# Altium project GardenSense Rev B.PrjPcb
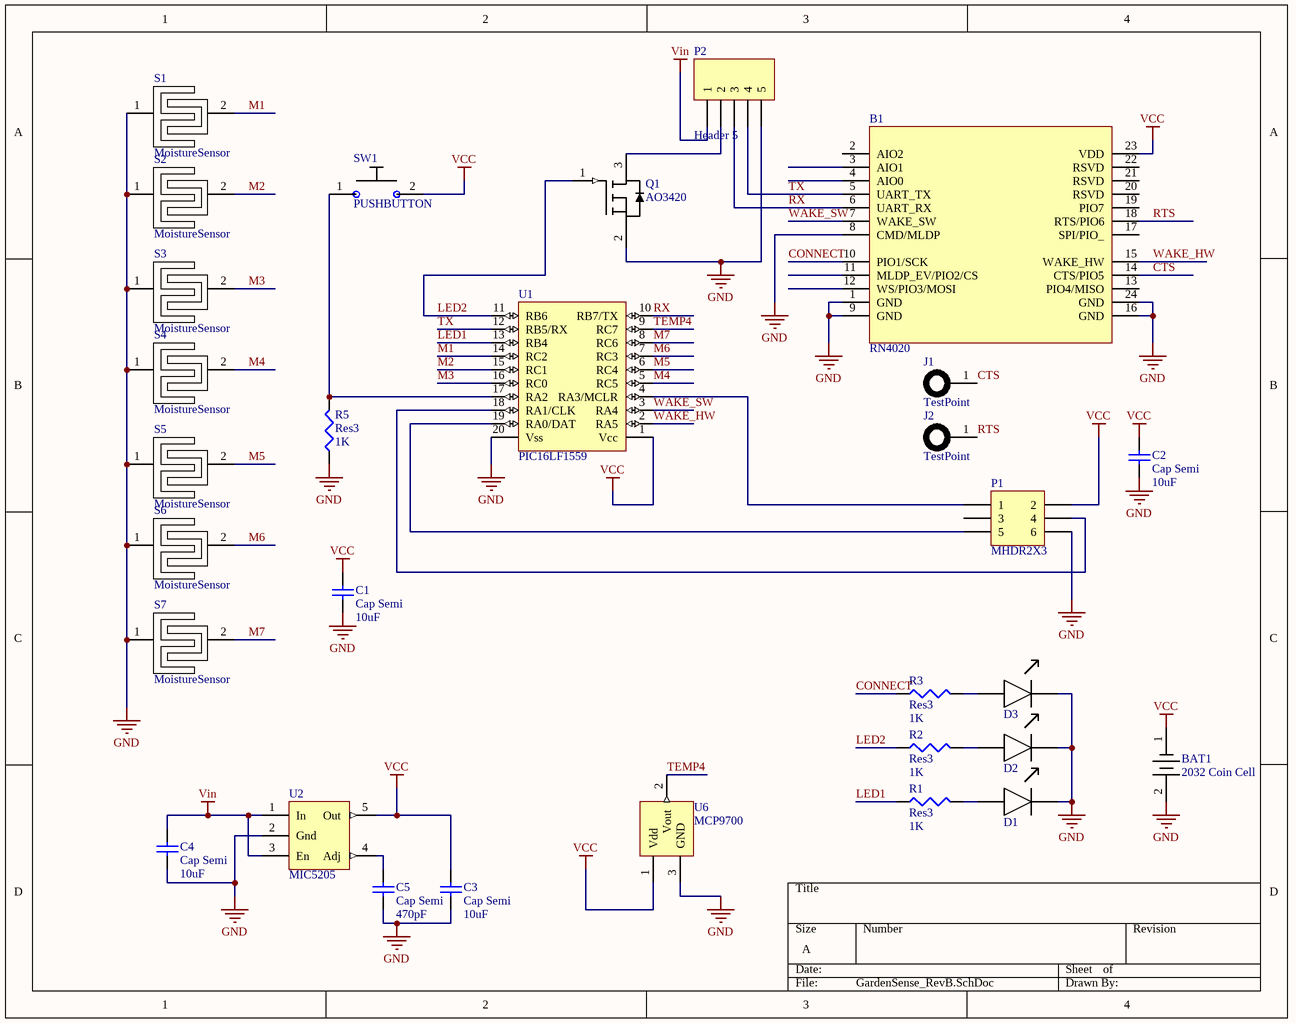
[diagram p0: GardenSense_RevB.SchDoc]
1 sheet, 30 parts. Net scope: global (net labels, ports and power ports of the same name join across sheets).
Board file: GardenSense_RevB.PcbDoc

## Sheet GardenSense_RevB.SchDoc
size A

### Parts
B1  RN4020  [RN4020 MODULE-24]
BAT1  2032 Coin Cell  [Keystone_3002_2032_CoinCell]
C1  Cap Semi  value 10uF  [1608[0603]]
C2  Cap Semi  value 10uF  [1608[0603]]
C3  Cap Semi  value 10uF  [1608[0603]]
C4  Cap Semi  value 10uF  [1608[0603]]
C5  Cap Semi  value 470pF  [1608[0603]]
D1  LED  [603_]  (value not drawn)
D2  LED  [603_]  (value not drawn)
D3  LED  [603_]  (value not drawn)
J1  TestPoint  [TestPoint]
J2  TestPoint  [TestPoint]
P1  MHDR2X3  [MHDR2X3]
P2  Header 5  [HDR1X5]
Q1  AO3420  [SOT23_N]
R1  Res3  value 1K  [J1-0603]
R2  Res3  value 1K  [J1-0603]
R3  Res3  value 1K  [J1-0603]
R5  Res3  value 1K  [J1-0603]
S1  MoistureSensor  [MOISTURE_2]
S2  MoistureSensor  [MOISTURE_2]
S3  MoistureSensor  [MOISTURE_2]
S4  MoistureSensor  [MOISTURE_2]
S5  MoistureSensor  [MOISTURE_2]
S6  MoistureSensor  [MOISTURE_2]
S7  MoistureSensor  [MOISTURE_2]
SW1  PUSHBUTTON  [PUSHBUTTON]
U1  PIC16LF1559  [SSOP-20]
U2  MIC5205  [SOT23-5_N]
U6  MCP9700  [SOT23_M]

### Nets
GND: B1.1(GND) B1.8(CMD/MLDP) B1.9(GND) B1.16(GND) B1.24(GND) BAT1.2 C1.1 C2.1 C3.1 C4.1 C5.1 D1.2 D2.2 D3.2 P1.6 P2.5 Q1.2(S) R5.1 S1.1 S2.1 S3.1 S4.1 S5.1 S6.1 S7.1 U1.20(Vss) U2.2(Gnd) U6.3(GND)
VCC: B1.23(VDD) BAT1.1 C1.2 C2.2 C3.2 P1.2 SW1.2 U1.1(Vcc) U2.5(Out) U6.1(Vdd)
Vin: C4.2 P2.1 U2.1(In) U2.3(En)
CONNECT: B1.10(PIO1/SCK) R3.1
CTS: B1.14(CTS/PIO5) J1.1
LED1: R1.1 U1.13(RB4)
LED2: Q1.1(G) R2.1 U1.11(RB6)
M1: S1.2 U1.14(RC2)
M2: S2.2 U1.15(RC1)
M3: S3.2 U1.16(RC0)
M4: S4.2 U1.5(RC5)
M5: S5.2 U1.6(RC4)
M6: S6.2 U1.7(RC3)
M7: S7.2 U1.8(RC6)
RTS: B1.18(RTS/PIO6) J2.1
RX: B1.6(UART_RX) P2.3 U1.10(RB7/TX)
TEMP4: U1.9(RC7) U6.2(Vout)
TX: B1.5(UART_TX) P2.4 U1.12(RB5/RX)
WAKE_HW: B1.15(WAKE_HW) U1.2(RA5)
WAKE_SW: B1.7(WAKE_SW) U1.3(RA4)
NetC5_2: C5.2 U2.4(Adj)
NetD1_1: D1.1 R1.2
NetD2_1: D2.1 R2.2
NetD3_1: D3.1 R3.2
NetP1_1: P1.1 U1.4(RA3/MCLR)
NetP1_4: P1.4 U1.18(RA1/CLK)
NetP1_5: P1.5 U1.19(RA0/DAT)
NetP2_2: P2.2 Q1.3(D)
NetR5_2: R5.2 SW1.1 U1.17(RA2)

Not connected (* = marked no-connect by the designer): B1 2(AIO2) 3(AIO1) 4(AIO0) 11(MLDP_EV/PIO2/CS) 12(WS/PIO3/MOSI) 13(PIO4/MISO) 17(SPI/PIO_) 19(PIO7) 20(RSVD) 21(RSVD) 22(RSVD); P1 3

### Library data of the parts
C1-C5 = Cap Semi: Capacitor (Semiconductor SIM Model); Published: 8-Jun-2000; LatestRevisionDate: 29-May-2009; LatestRevisionNote: IPC-7351 Footprint Added.; PackageReference: C1206; Publisher: Altium Limited; PackageDescription: Chip Capacitor
P1 = MHDR2X3: Header, 3-Pin, Dual row; LatestRevisionDate: 17-Jul-2002; LatestRevisionNote: Re-released for DXP Platform.; Publisher: Altium Limited
P2 = Header 5: Header, 5-Pin; LatestRevisionDate: 17-Jul-2002; LatestRevisionNote: Re-released for DXP Platform.; Publisher: Altium Limited
R1-R3 R5 = Res3: Resistor; Published: 8-Jun-2000; LatestRevisionDate: 29-May-2009; LatestRevisionNote: IPC-7351 Footprint Added.; PackageReference: J1-0603; Publisher: Altium Limited; PackageDescription: Chip Resistor
S1-S7 = MoistureSensor: pin to pad: 1>0 2>1
SW1 = PUSHBUTTON: TE 5-1437565-0